# EAGLE design placaPadrãoATmega328 (EAGLE 7.6.0)
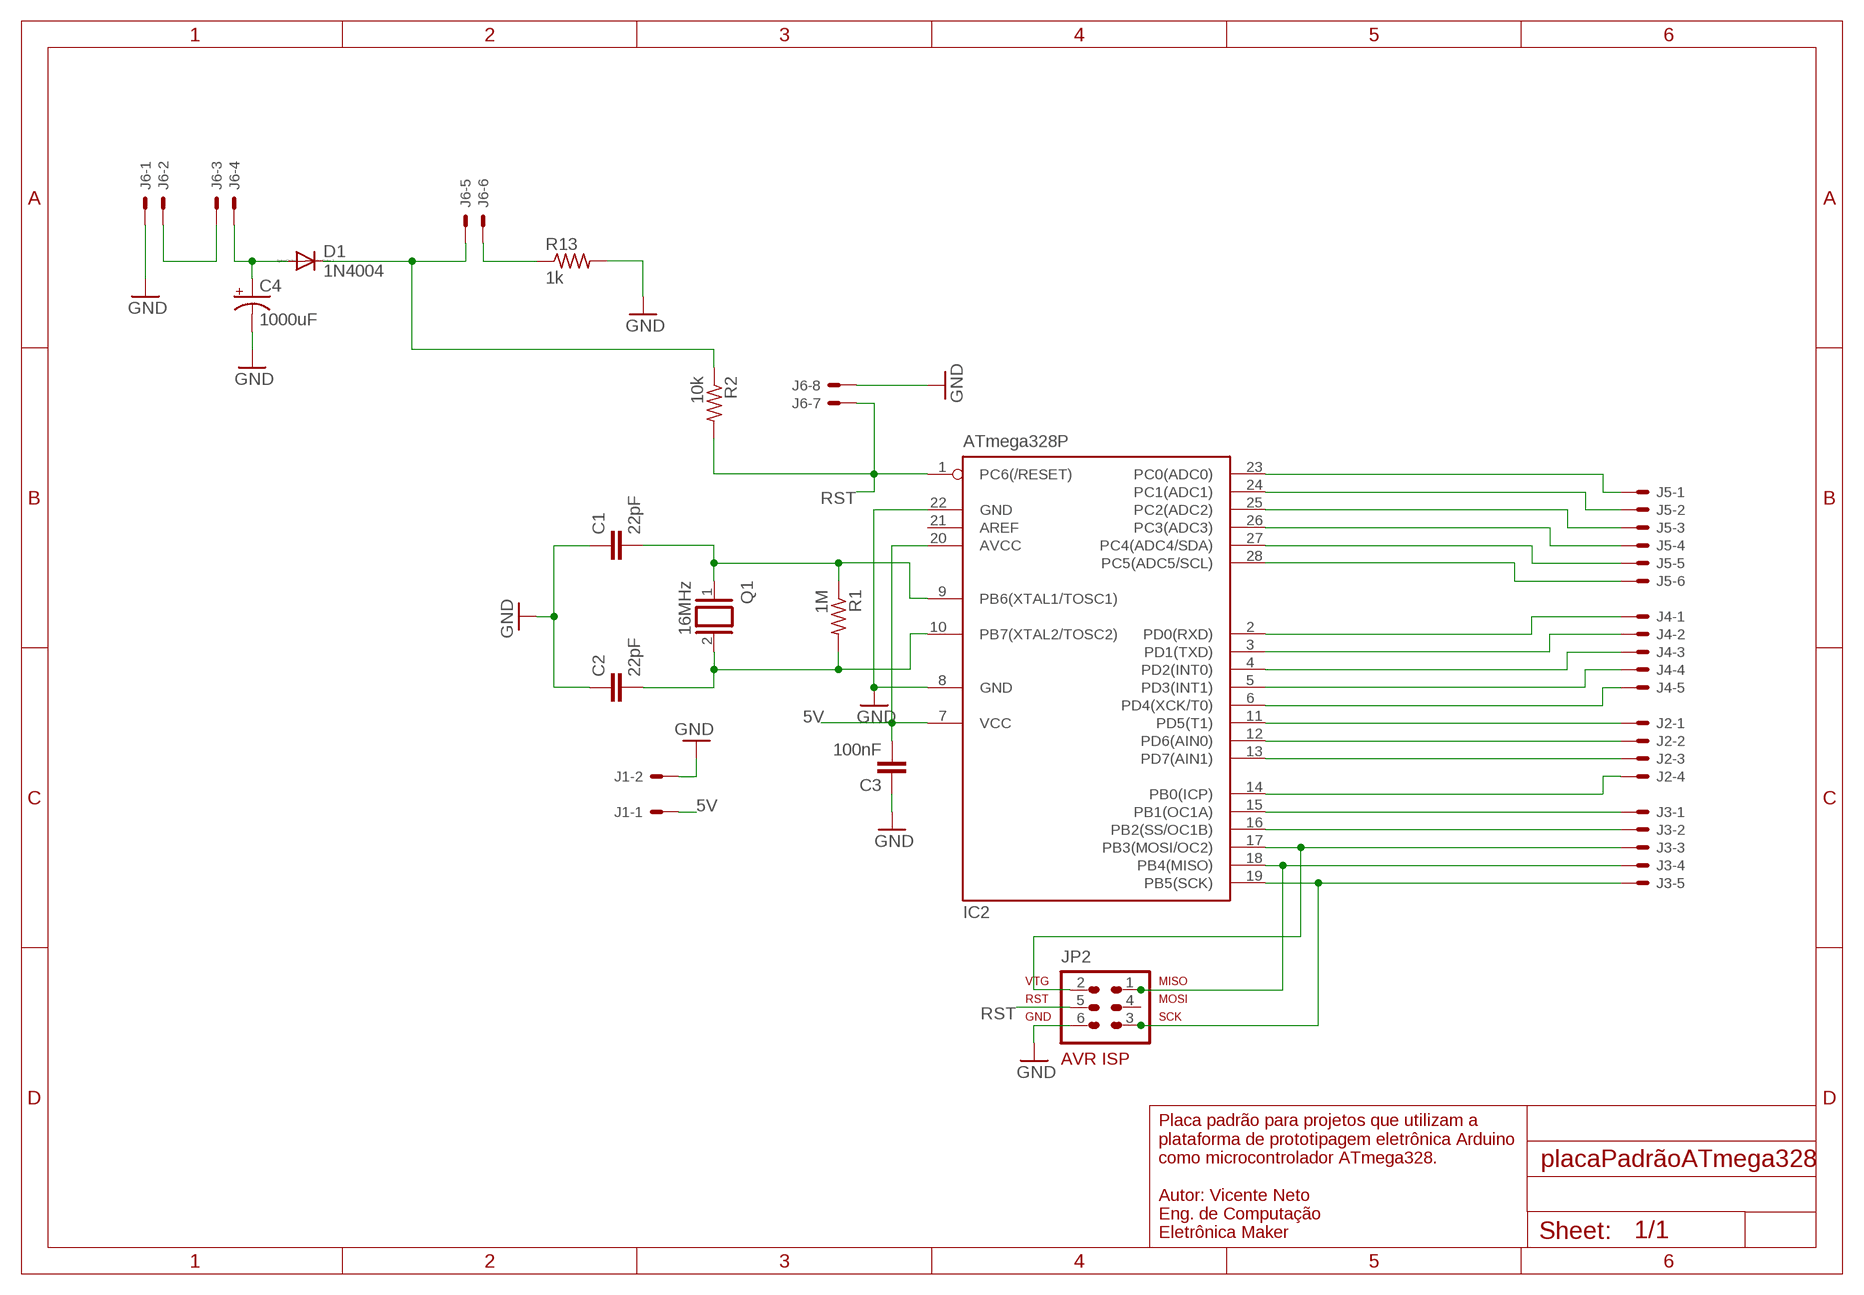
[diagram p0: schematic, sheet 1]

## Parts
C1  22pF  C-EU025-025X050  [C025-025X050]
C2  22pF  C-EU025-025X050  [C025-025X050]
C3  100nF  C-EU025-025X050  [C025-025X050]
C4  1000uF  CPOL-USE5-10.5  [E5-10,5]
D1  1N4004  [DO41-10]
IC2  ATmega328P  MEGA8-P  [DIL28-3]
J1  22-27-2021-02  [6410-02]
J2  22-27-2041-04  [6410-04]
J3  22-27-2051-05  [6410-05]
J4  22-27-2051-05  [6410-05]
J5  22-27-2061-06  [6410-06]
J6  22-27-2081-08  [6410-08]
JP2  ICSP  AVR-ISP-6  [AVR-ISP-6]
Q1  16MHz  XTAL/S  [QS]
R1  1M  R-US_0204/7  [0204/7]
R2  10k  R-US_0204/7  [0204/7]
R13  1k  R-US_0204/7  [0204/7]

## Nets
5V: C3.2 D1.C IC2.7(VCC) IC2.20(AVCC) J1.1 J6.5 R2.1
A0: IC2.23(PC0(ADC0)) J5.1
A1: IC2.24(PC1(ADC1)) J5.2
A2: IC2.25(PC2(ADC2)) J5.3
A3: IC2.26(PC3(ADC3)) J5.4
A4: IC2.27(PC4(ADC4/SDA)) J5.5
A5: IC2.28(PC5(ADC5/SCL)) J5.6
GND: C1.1 C2.1 C3.1 C4.- IC2.8(GND) IC2.22(GND) J1.2 J6.1 J6.8 JP2.6 R13.2
N$1: C1.2 IC2.9(PB6(XTAL1/TOSC1)) Q1.1 R1.1
N$2: C2.2 IC2.10(PB7(XTAL2/TOSC2)) Q1.2 R1.2
N$4: IC2.19(PB5(SCK)) J3.5 JP2.3
N$5: C4.+ D1.A J6.4
N$6: IC2.3(PD1(TXD)) J4.2
N$9: IC2.18(PB4(MISO)) J3.4 JP2.1
N$11: IC2.17(PB3(MOSI/OC2)) J3.3 JP2.2
N$13: IC2.2(PD0(RXD)) J4.1
N$14: IC2.4(PD2(INT0)) J4.3
N$15: IC2.5(PD3(INT1)) J4.4
N$16: IC2.6(PD4(XCK/T0)) J4.5
N$17: IC2.11(PD5(T1)) J2.1
N$18: IC2.12(PD6(AIN0)) J2.2
N$19: IC2.13(PD7(AIN1)) J2.3
N$20: IC2.14(PB0(ICP)) J2.4
N$21: IC2.15(PB1(OC1A)) J3.1
N$22: IC2.16(PB2(SS/OC1B)) J3.2
N$26: J6.2 J6.3
N$31: J6.6 R13.1
RST: IC2.1(PC6(/RESET)) J6.7 JP2.5 R2.2
Unconnected: IC2.21(AREF) JP2.4

## Notes on the sheet
- Placa padrão para projetos que utilizam a 
  plataforma de prototipagem eletrônica Arduino
  como microcontrolador ATmega328.
  
  Autor: Vicente Neto
  Eng. de Computação
  Eletrônica Maker

## Library data of the parts
C1-C3 = rcl:C-EU: CAPACITOR, European symbol
C4 = rcl:CPOL-US: POLARIZED CAPACITOR, American symbol
D1 = diode:1N4004: DIODE general purpose rectifier, 1 A
IC2 = atmel:MEGA8-P: MICROCONTROLLER 8 Kbytes FLASH, 1 kbytes SRAM, 512 bytes EEPROM, USART, 4-channel 10 bit ADC, 2-channel 8 bit ADC Pin compatible with Atmega48, ATMega88, ATMega168 Source: avr.lbr; OC_FARNELL: unknown; OC_NEWARK: unknown
J1 = con-molex:22-?-02: CONNECTOR wire to board 2.54 mm (.1 inch) pitch header; OC_FARNELL: unknown; OC_NEWARK: unknown
J2 = con-molex:22-?-04: CONNECTOR wire to board 2.54 mm (.1 inch) pitch header; OC_FARNELL: unknown; OC_NEWARK: unknown
J3 J4 = con-molex:22-?-05: CONNECTOR wire to board 2.54 mm (.1 inch) pitch header; OC_FARNELL: unknown; OC_NEWARK: unknown
J5 = con-molex:22-?-06: CONNECTOR wire to board 2.54 mm (.1 inch) pitch header; OC_FARNELL: unknown; OC_NEWARK: unknown
J6 = con-molex:22-?-08: CONNECTOR wire to board 2.54 mm (.1 inch) pitch header; OC_FARNELL: unknown; OC_NEWARK: unknown
JP2 = avr-4:AVR-ISP-6: AVR ISP-6 Serial Programming Header
Q1 = special:XTAL/S: CRYSTAL
R1 R2 R13 = resistor:R-US_: RESISTOR, American symbol

## Board
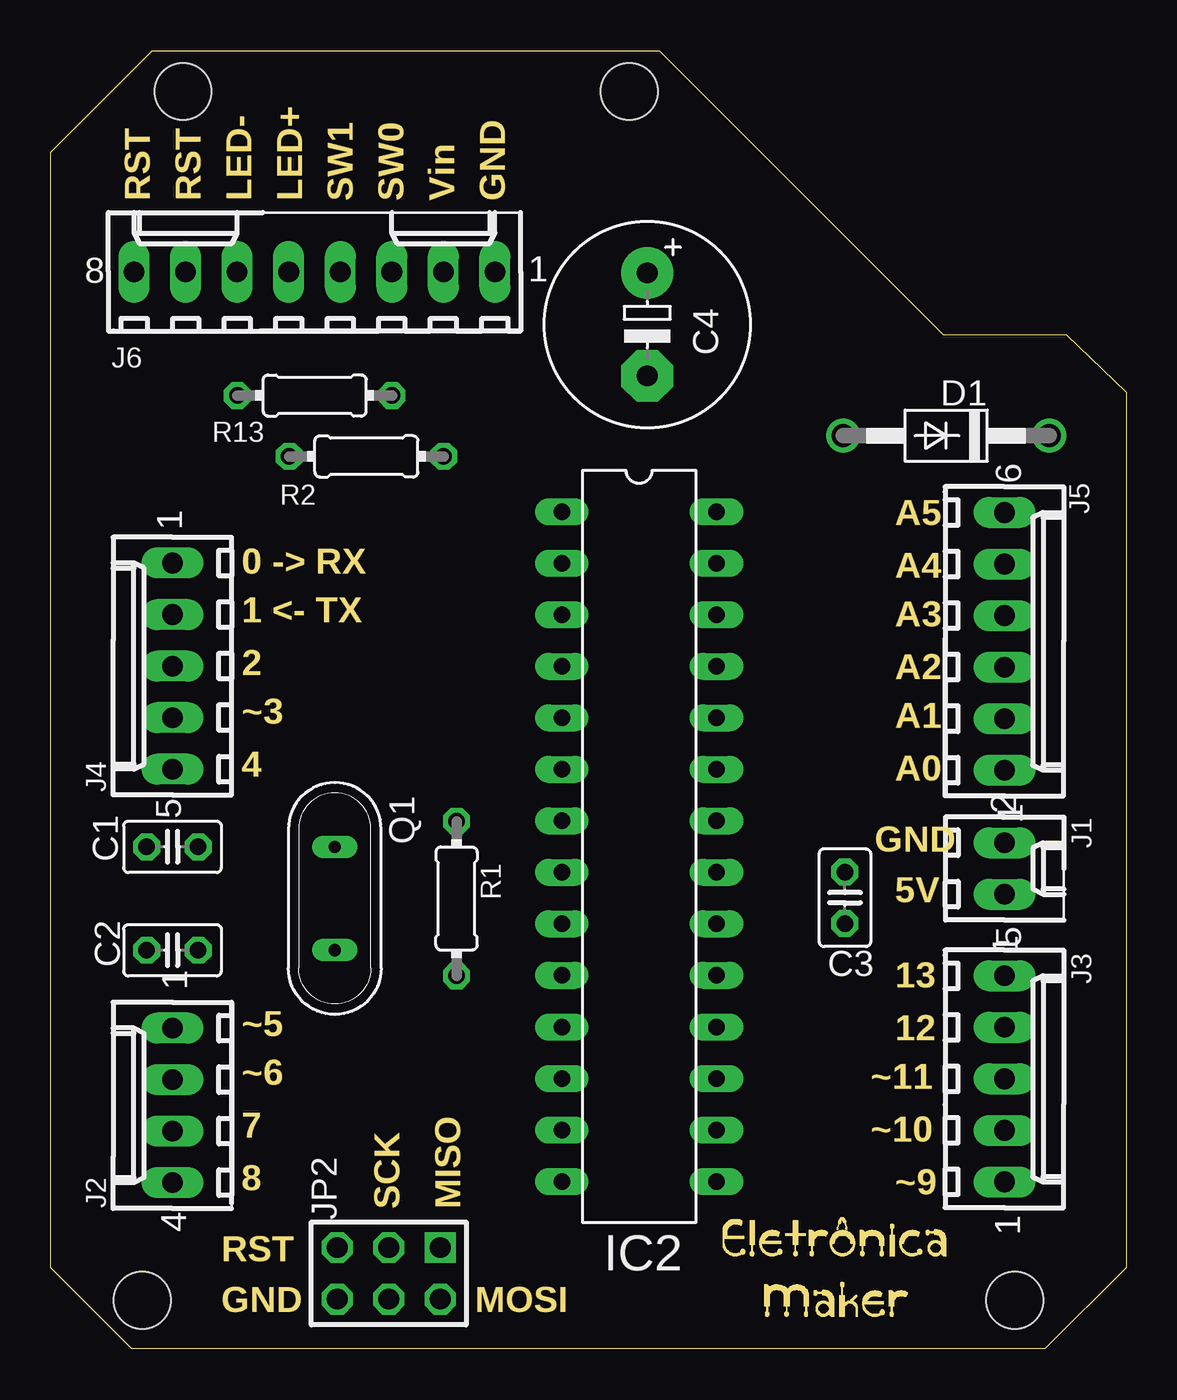
[diagram p1: board, top side]
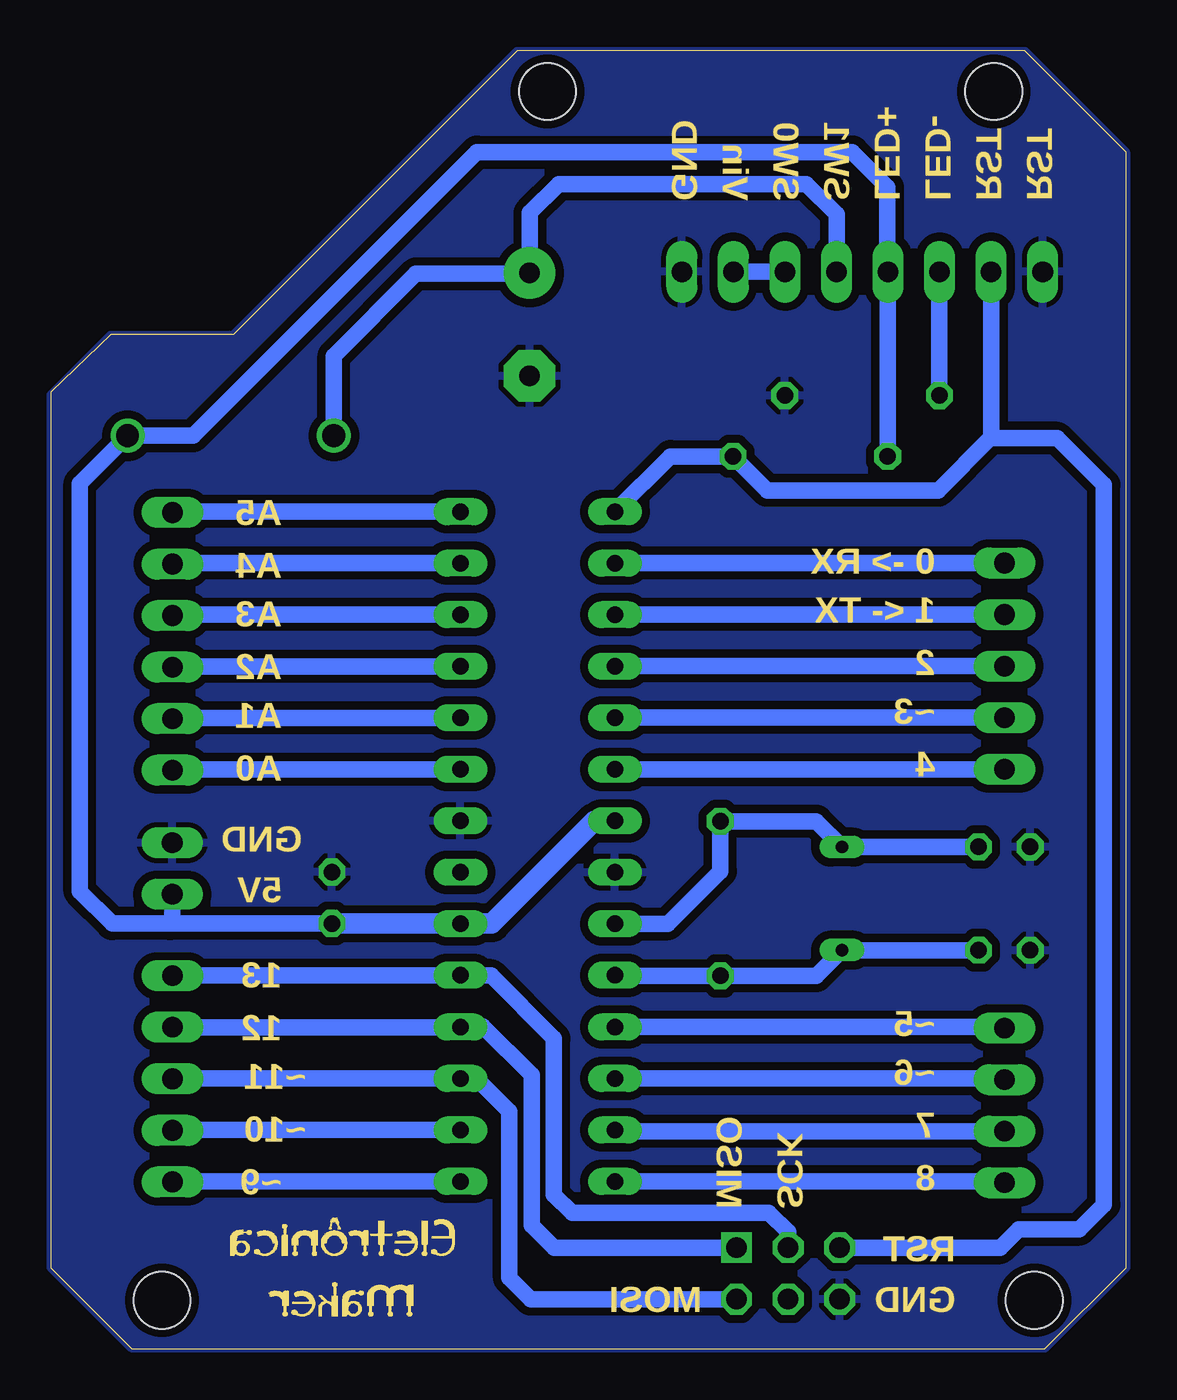
[diagram p2: board, bottom side, seen from below]

Size 53 x 64 mm. Coordinates in mm from the lower left corner, seen from the top.
Outline: 53,4 49,0 4,0 0,4 0,59 5,64 30,64 44,50 50.04,50 53,47.17 53,4
Copper layers (1*16): Top 0.035mm / dielectric 1.5mm / Bottom 0.035mm
Design rules "default *": minimum track width 10mil, minimum drill 24mil, track to track 8mil, track to pad 8mil, pad to pad 8mil, via to via 8mil, smd to smd 8mil, copper to edge 0mil, drill to drill 8mil, minimum pad ring 10mil, minimum via ring 8mil, stop-mask expansion 4mil, vias tented up to drill 0mil, thermal gap 10mil
Holes 2.8 mm at 4.52,2.39 6.52,61.99 47.52,2.39 28.52,61.99

### Footprints (pad centres in the part's own frame; a part is rotated, then mirrored left to right if it is on the bottom)
C025-025X050 = drill 0.813 octagon: 1 -1.27,0; 2 1.27,0
E5-10,5 = drill 1.016 pad 2.54: + -2.54,0 | drill 1.016 pad 2.54 octagon: - 2.54,0
DO41-10 = drill 1.118: A 5.08,0; C -5.08,0
DIL28-3 = drill 0.813 long: 1 -16.51,-3.81; 2 -13.97,-3.81; 3 -11.43,-3.81; 4 -8.89,-3.81; 5 -6.35,-3.81; 6 -3.81,-3.81; 7 -1.27,-3.81; 8 1.27,-3.81; 9 3.81,-3.81; 10 6.35,-3.81; 11 8.89,-3.81; 12 11.43,-3.81; 13 13.97,-3.81; 14 16.51,-3.81; 15 16.51,3.81; 16 13.97,3.81; 17 11.43,3.81; 18 8.89,3.81; 19 6.35,3.81; 20 3.81,3.81; 21 1.27,3.81; 22 -1.27,3.81; 23 -3.81,3.81; 24 -6.35,3.81; 25 -8.89,3.81; 26 -11.43,3.81; 27 -13.97,3.81; 28 -16.51,3.81
6410-02 = drill 1.016 long: 1 1.27,0; 2 -1.27,0
6410-04 = drill 1.016 long: 1 3.81,0; 2 1.27,0; 3 -1.27,0; 4 -3.81,0
6410-05 = drill 1.016 long: 1 5.08,0; 2 2.54,0; 3 0,0; 4 -2.54,0; 5 -5.08,0
6410-06 = drill 1.016 long: 1 6.35,0; 2 3.81,0; 3 1.27,0; 4 -1.27,0; 5 -3.81,0; 6 -6.35,0
6410-08 = drill 1.016 long: 1 8.89,0; 2 6.35,0; 3 3.81,0; 4 1.27,0; 5 -1.27,0; 6 -3.81,0; 7 -6.35,0; 8 -8.89,0
AVR-ISP-6 = drill 1.016 square: 1 -2.54,-1.27 | drill 1.016 octagon: 2 -2.54,1.27; 3 0,-1.27; 4 0,1.27; 5 2.54,-1.27; 6 2.54,1.27
QS = drill 0.61 long: 1 -2.54,0; 2 2.54,0
0204/7 = drill 0.813 octagon: 1 -3.81,0; 2 3.81,0

### Placement (x,y rotation side)
C1  6,24.75 0 top
C2  6,19.65 0 top
C3  39.14,22.24 270 top
C4  29.4,50.5 270 top
D1  44.13,45.02 180 top
IC2  29,24.76 270 top
J1  47.01,23.68 270 top
J2  6,12 90 top
J3  47,13.31 270 top
J4  6,33.66 90 top
J5  47,34.88 270 top
J6  13,53.1 0 top
JP2  16.66,3.72 180 top
Q1  14,22.2 270 top
R1  20,22.2 270 top
R2  15.56,44 0 top
R13  13.01,47 0 top

### Tracks (layer width: path | path; a pad name or v marks a point on that pad's centre or on a via)
5V
  Bottom 0.813: C3.2 47.11,20.97 | 47.11,20.97 49.97,20.97 51.56,22.56 51.56,42.67 D1.C 45.98,45.02 32,59 13.49,59 11.76,57.27 11.76,53.13 J6.5 11.75,53.1 R2.1 | J1.1 47.01,21.07 47.11,20.97
  Bottom 1.016: C3.2 32.83,20.97 | 32.83,20.97 IC2.20 | 32.83,20.97 31.26,20.97 26.21,26.02 25.2,26.02 IC2.7
A0
  Bottom 0.813: IC2.23 46.96,28.57 J5.1
A1
  Bottom 0.813: IC2.24 46.96,31.11 J5.2
A2
  Bottom 0.813: IC2.25 46.96,33.65 J5.3
A3
  Bottom 0.813: IC2.26 46.96,36.19 J5.4
A4
  Bottom 0.813: IC2.27 46.96,38.73 J5.5
A5
  Bottom 0.813: IC2.28 46.96,41.27 J5.6
GND
  pour Bottom (isolate 0.406): 0,4 4,0 49,0 53,4 53,47.04 50.04,50 44,50 30,64 5,64 0,59 0,4.01 -0.01,4
N$1
  Bottom 0.813: C1.2 Q1.1 15.27,26.01 R1.1 19.99,26 19.99,23.54 22.58,20.95 IC2.9
N$2
  Bottom 0.813: C2.2 13.99,19.65 Q1.2 15.27,18.39 R1.2 25.17,18.39 IC2.10
N$4
  Bottom 0.813: J3.5 46.98,18.41 IC2.19 32.8,18.4 31.3,18.4 28.2,15.3 28.2,7.6 27.3,6.7 17.6,6.7 16.66,5.76 JP2.3
N$5
  Bottom 0.813: D1.A 39.05,48.95 35,53 29.44,53 C4.+ 29.39,56.01 27.97,57.43 15.77,57.43 14.27,55.93 J6.4
N$6
  Bottom 0.813: J4.2 IC2.3
N$9
  Bottom 0.813: J3.4 32.83,15.85 IC2.18 32.78,15.9 31.7,15.9 29.3,13.5 29.3,6.1 28.19,4.99 JP2.1
N$11
  Bottom 0.813: J3.3 46.98,13.33 IC2.17 32.78,13.3 32,13.3 30.4,11.7 30.4,3.5 29.35,2.45 JP2.2
N$13
  Bottom 0.813: J4.1 IC2.2
N$14
  Bottom 0.813: J4.3 IC2.4
N$15
  Bottom 0.813: J4.4 IC2.5
N$16
  Bottom 0.813: IC2.6 6.01,28.57 J4.5
N$17
  Bottom 0.813: IC2.11 6.06,15.87 J2.1
N$18
  Bottom 0.813: IC2.12 6.06,13.33 J2.2
N$19
  Bottom 0.813: J2.3 25.13,10.73 IC2.13
N$20
  Bottom 0.813: IC2.14 6.06,8.25 J2.4
N$21
  Bottom 0.813: IC2.15 46.98,8.25 J3.1
N$22
  Bottom 0.813: IC2.16 46.98,10.79 J3.2
N$26
  Bottom 0.813: J6.2 J6.3
N$31
  Bottom 0.813: R13.1 9.2,53.09 J6.6
RST
  Bottom 0.813: J6.7 6.65,44.94 6.69,44.9 | 6.69,44.9 9.27,42.32 17.69,42.32 R2.2 22.46,44 IC2.1 | JP2.5 6.21,4.99 5.3,5.9 2.3,5.9 1.1,7.1 1.1,42.6 3.4,44.9 6.69,44.9

### Text on the board
Dimension: RST | RST | LED- | LED+ | SW1 | SW0 | Vin | GND | A5 | 0 -> RX | A4 | 1 <- TX | A3 | 2 | A2 | ~3 | A1 | 4 | A0 | GND | 5V | 13 | ~5 | 12 | ~6 | ~11 | 7 | ~10 | 8 | SCK | MISO | ~9 | RST | GND | MOSI